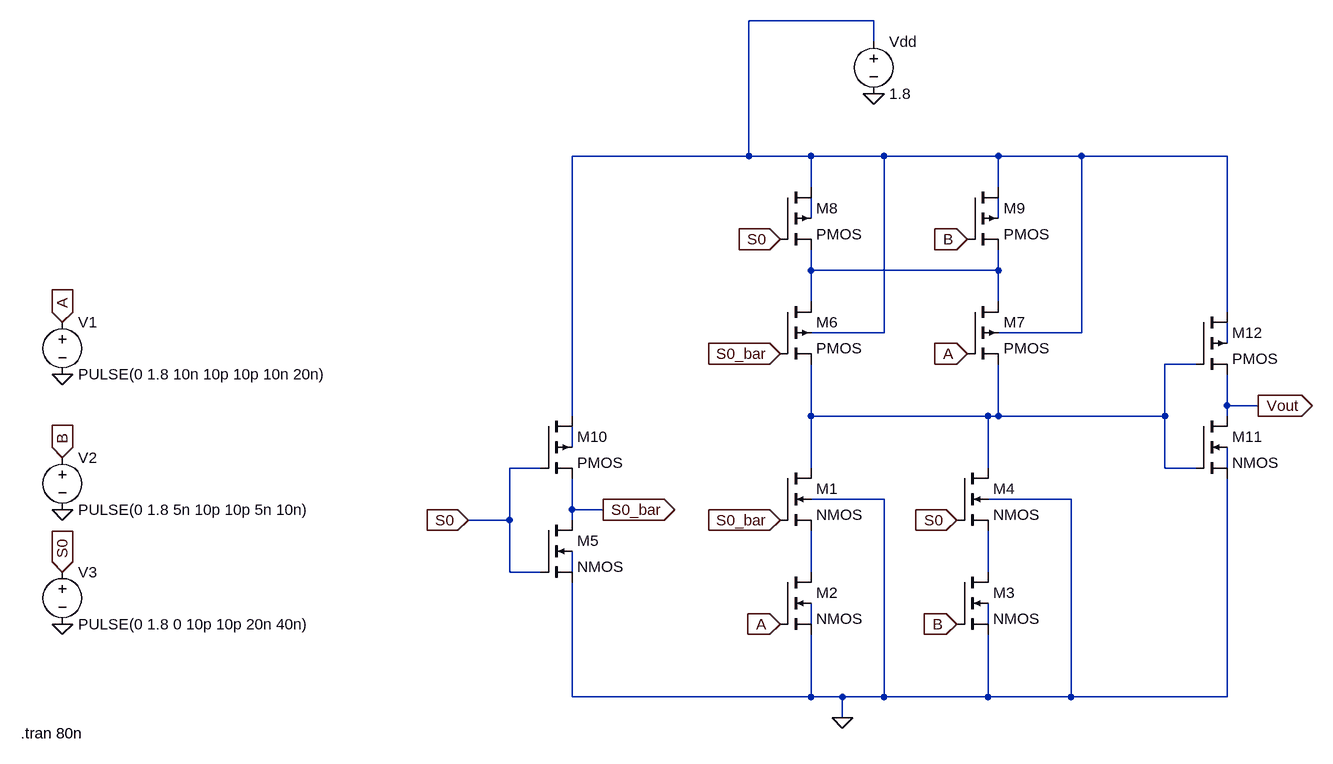
[diagram p0: schematic 2to1mux.asc]
2to1mux.asc, the LTspice schematic file:
Version 4.1
SHEET 1 880 680
WIRE 128 -544 -64 -544
WIRE 128 -512 128 -544
WIRE -64 -336 -64 -544
WIRE -64 -336 -336 -336
WIRE 32 -336 -64 -336
WIRE 144 -336 32 -336
WIRE 320 -336 144 -336
WIRE 448 -336 320 -336
WIRE 672 -336 448 -336
WIRE 32 -288 32 -336
WIRE 320 -288 320 -336
WIRE 32 -240 32 -272
WIRE 320 -240 320 -272
WIRE 32 -160 32 -192
WIRE 320 -160 320 -192
WIRE 320 -160 32 -160
WIRE 32 -112 32 -160
WIRE 320 -112 320 -160
WIRE 672 -96 672 -336
WIRE 144 -64 144 -336
WIRE 144 -64 32 -64
WIRE 448 -64 448 -336
WIRE 448 -64 320 -64
WIRE 672 -48 672 -80
WIRE 624 -16 576 -16
WIRE 672 48 672 0
WIRE 720 48 672 48
WIRE -336 64 -336 -336
WIRE 32 64 32 -16
WIRE 304 64 32 64
WIRE 320 64 320 -16
WIRE 320 64 304 64
WIRE 576 64 576 -16
WIRE 576 64 320 64
WIRE 672 64 672 48
WIRE -336 112 -336 80
WIRE -384 144 -432 144
WIRE 32 144 32 64
WIRE 304 144 304 64
WIRE 576 144 576 64
WIRE 624 144 576 144
WIRE 672 144 672 112
WIRE 144 192 32 192
WIRE 432 192 304 192
WIRE -336 208 -336 160
WIRE -288 208 -336 208
WIRE -432 224 -432 144
WIRE -432 224 -496 224
WIRE -336 224 -336 208
WIRE -432 304 -432 224
WIRE -384 304 -432 304
WIRE -336 304 -336 272
WIRE 32 304 32 240
WIRE 304 304 304 240
WIRE 32 384 32 352
WIRE 304 384 304 352
WIRE -336 496 -336 320
WIRE 32 496 32 400
WIRE 32 496 -336 496
WIRE 80 496 32 496
WIRE 144 496 144 192
WIRE 144 496 80 496
WIRE 304 496 304 400
WIRE 304 496 144 496
WIRE 432 496 432 192
WIRE 432 496 304 496
WIRE 672 496 672 160
WIRE 672 496 432 496
WIRE 80 528 80 496
FLAG 128 -432 0
FLAG -1120 384 0
FLAG -1120 208 0
FLAG -1120 0 0
FLAG 272 -32 A
IOPIN 272 -32 In
FLAG -16 384 A
IOPIN -16 384 In
FLAG -1120 -80 A
IOPIN -1120 -80 In
FLAG 256 384 B
IOPIN 256 384 In
FLAG 272 -208 B
IOPIN 272 -208 In
FLAG -1120 128 B
IOPIN -1120 128 In
FLAG -496 224 S0
IOPIN -496 224 In
FLAG -1120 304 S0
IOPIN -1120 304 In
FLAG -16 -208 S0
IOPIN -16 -208 In
FLAG 256 224 S0
IOPIN 256 224 In
FLAG -16 -32 S0_bar
IOPIN -16 -32 In
FLAG -16 224 S0_bar
IOPIN -16 224 In
FLAG -288 208 S0_bar
IOPIN -288 208 Out
FLAG 80 528 0
FLAG 720 48 Vout
IOPIN 720 48 Out
SYMBOL nmos4 -16 144 R0
SYMATTR InstName M1
SYMATTR Value2 l=180n w=800n
SYMBOL nmos4 -16 304 R0
SYMATTR InstName M2
SYMATTR Value2 l=180n w=800n
SYMBOL nmos4 256 304 R0
SYMATTR InstName M3
SYMATTR Value2 l=180n w=800n
SYMBOL nmos4 256 144 R0
SYMATTR InstName M4
SYMATTR Value2 l=180n w=800n
SYMBOL nmos4 -384 224 R0
SYMATTR InstName M5
SYMATTR Value2 l=180n w=400n
SYMBOL pmos4 -16 -112 R0
SYMATTR InstName M6
SYMATTR Value2 l=180n w=1600n
SYMBOL pmos4 272 -112 R0
SYMATTR InstName M7
SYMATTR Value2 l=180n w=1600n
SYMBOL pmos4 -16 -288 R0
SYMATTR InstName M8
SYMATTR Value2 l=180n w=1600n
SYMBOL pmos4 272 -288 R0
SYMATTR InstName M9
SYMATTR Value2 l=180n w=1600n
SYMBOL pmos4 -384 64 R0
SYMATTR InstName M10
SYMATTR Value2 l=180n w=800n
SYMBOL voltage 128 -528 R0
WINDOW 123 0 0 Left 0
WINDOW 39 0 0 Left 0
SYMATTR InstName Vdd
SYMATTR Value 1.8
SYMBOL voltage -1120 -96 R0
WINDOW 123 0 0 Left 0
WINDOW 39 0 0 Left 0
SYMATTR InstName V1
SYMATTR Value PULSE(0 1.8 10n 10p 10p 10n 20n)
SYMBOL voltage -1120 112 R0
WINDOW 123 0 0 Left 0
WINDOW 39 0 0 Left 0
SYMATTR InstName V2
SYMATTR Value PULSE(0 1.8 5n 10p 10p 5n 10n)
SYMBOL voltage -1120 288 R0
WINDOW 123 0 0 Left 0
WINDOW 39 0 0 Left 0
SYMATTR InstName V3
SYMATTR Value PULSE(0 1.8 0 10p 10p 20n 40n)
SYMBOL nmos4 624 64 R0
SYMATTR InstName M11
SYMATTR Value2 l=180n w=400n
SYMBOL pmos4 624 -96 R0
SYMATTR InstName M12
SYMATTR Value2 l=180n w=800n
TEXT -1184 552 Left 2 !.tran 80n

The netlist it stands for:
* 2to1mux.asc
M1 N006 S0_bar N010 0 NMOS l=180n w=800n
M2 N010 A 0 N012 NMOS l=180n w=800n
M3 N011 B 0 N013 NMOS l=180n w=800n
M4 N006 S0 N011 0 NMOS l=180n w=800n
M5 S0_bar S0 0 N009 NMOS l=180n w=400n
M6 N004 S0_bar N006 N001 PMOS l=180n w=1600n
M7 N004 A N006 N001 PMOS l=180n w=1600n
M8 N001 S0 N004 N002 PMOS l=180n w=1600n
M9 N001 B N004 N003 PMOS l=180n w=1600n
M10 N001 S0 S0_bar N007 PMOS l=180n w=800n
Vdd N001 0 1.8
V1 A 0 PULSE(0 1.8 10n 10p 10p 10n 20n)
V2 B 0 PULSE(0 1.8 5n 10p 10p 5n 10n)
V3 S0 0 PULSE(0 1.8 0 10p 10p 20n 40n)
M11 Vout N006 0 N008 NMOS l=180n w=400n
M12 N001 N006 Vout N005 PMOS l=180n w=800n
.model NMOS NMOS
.model PMOS PMOS
.lib standard.mos
.tran 80n
.backanno
.end